# Altium schematic sheet 1 - SOM.SchDoc
size Tabloid
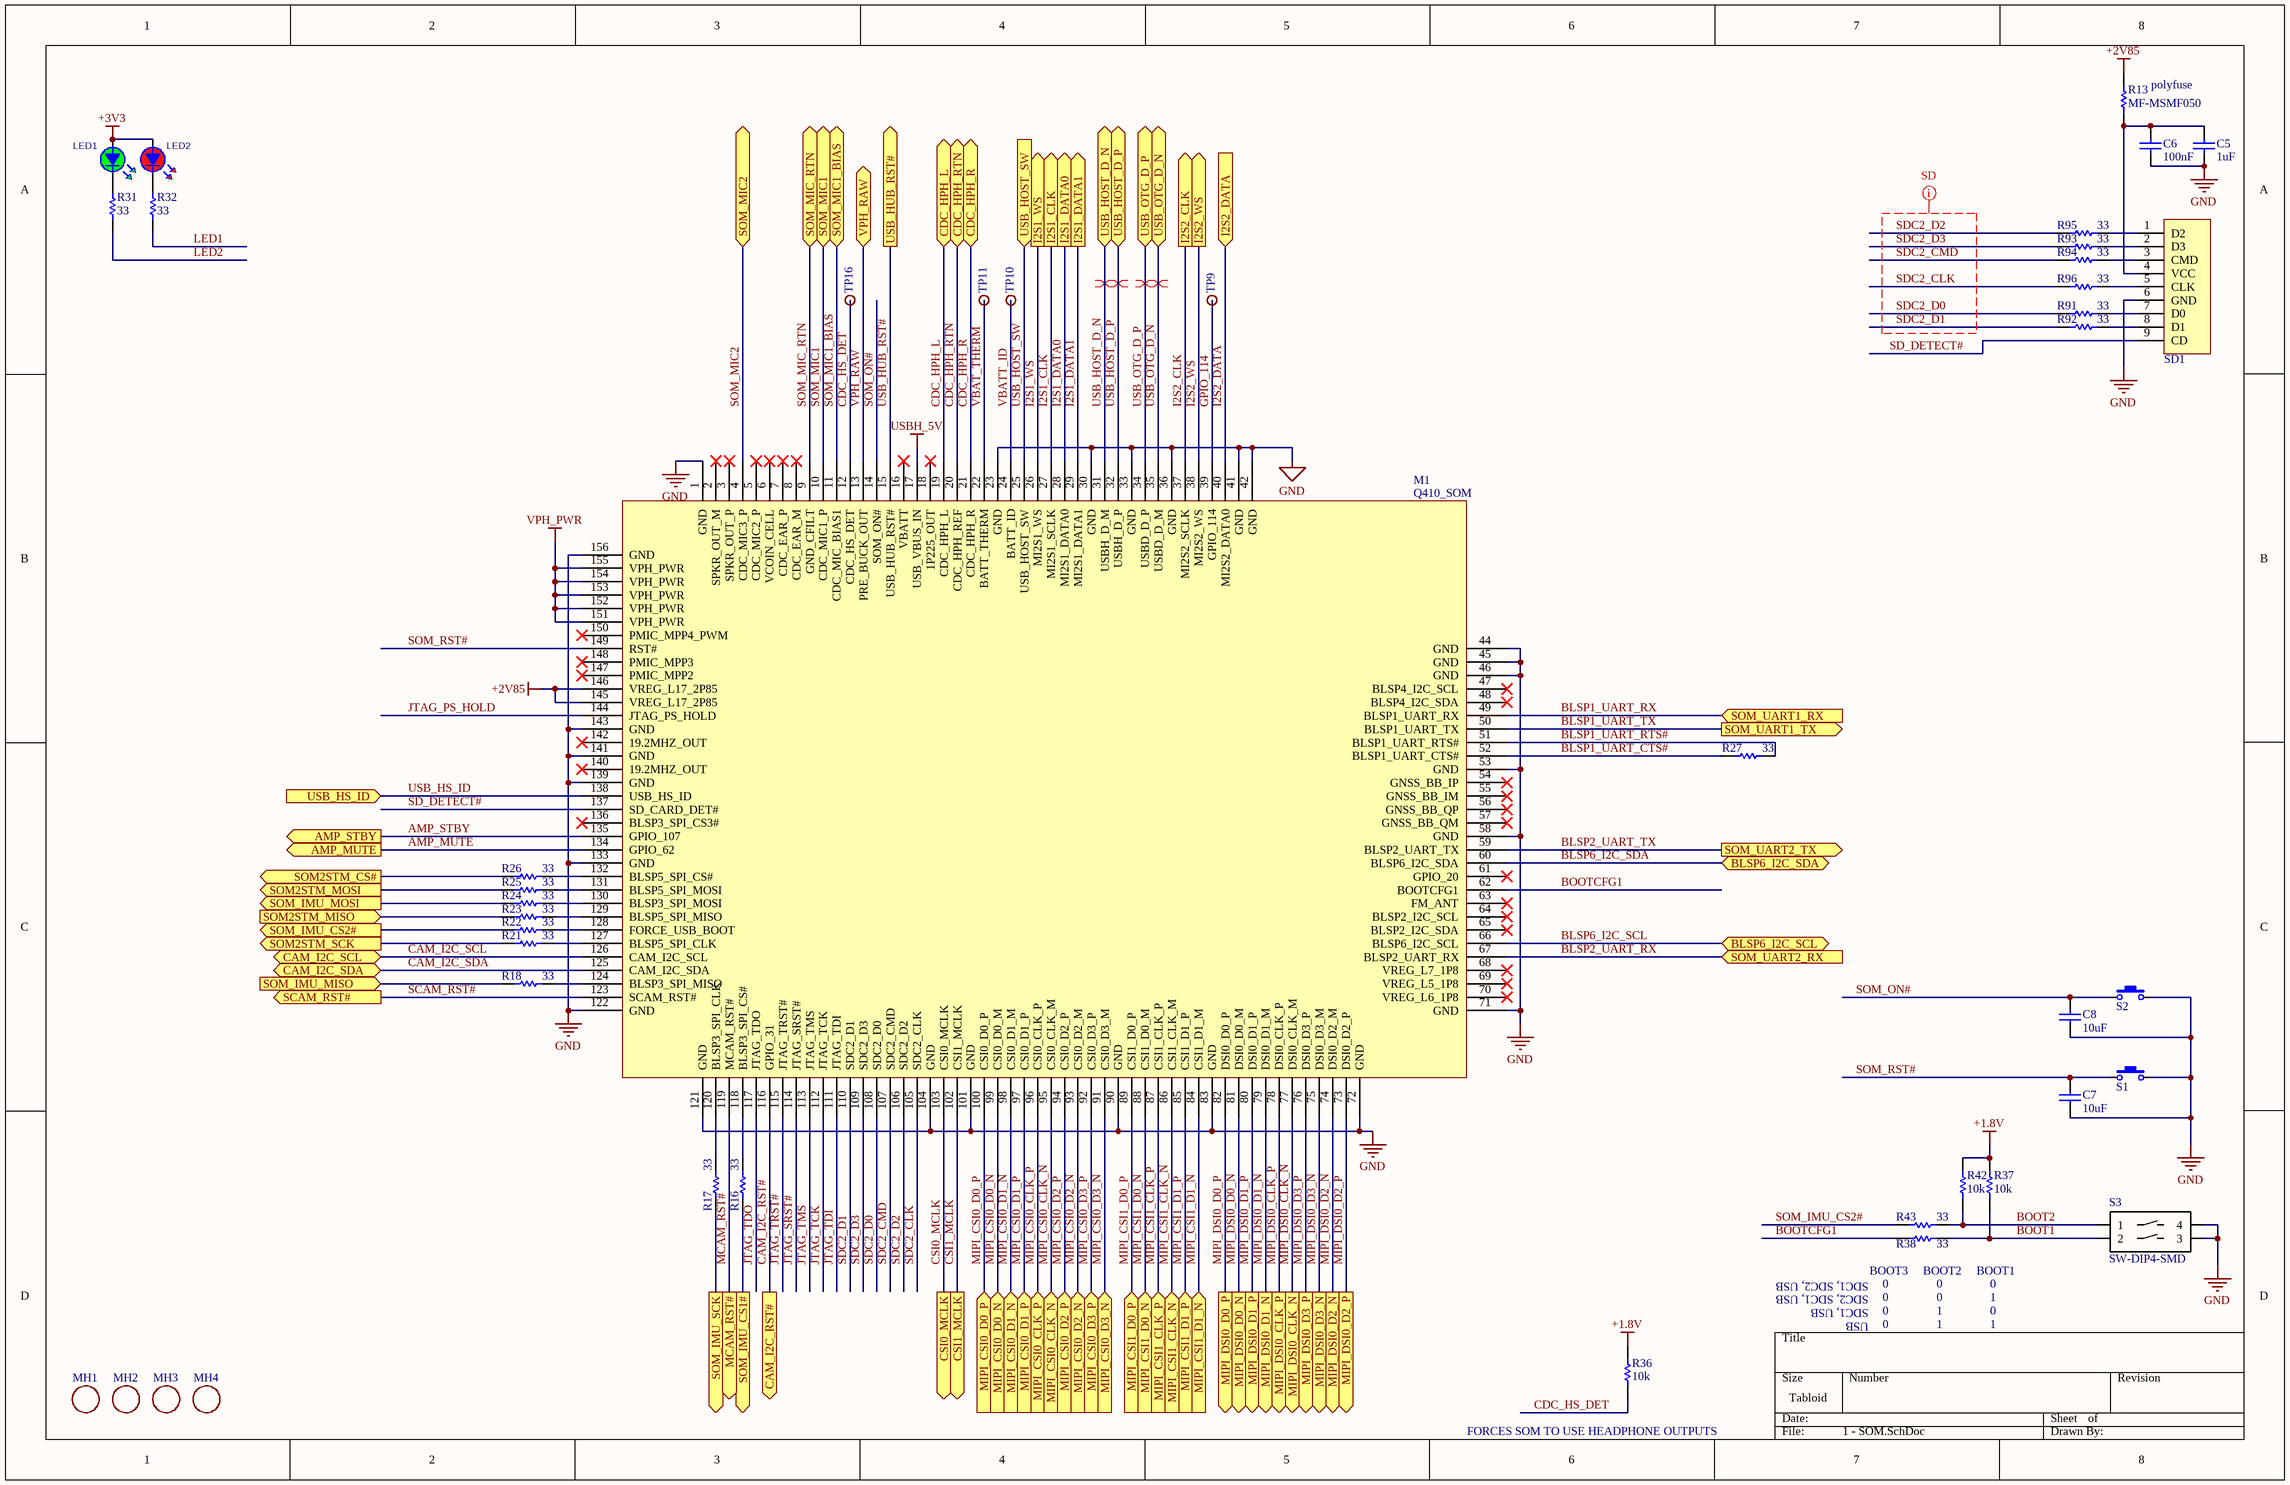
[diagram p0: 1 - SOM.SchDoc]

## Parts
C5  value 1uF  [CAPC0805(2012)100_L]  (hidden comment: CAP 1uF 6.3V 0805(2012))
C6  value 100nF  [CAPC0805(2012)100_N]  (hidden comment: CAP 100nF 6.3V 0805(2012))
C7  value 10uF  [CAPC0805(2012)100_L]  (hidden comment: CAP 10uF 6.3V 0805(2012))
C8  value 10uF  [CAPC0805(2012)100_L]  (hidden comment: CAP 10uF 6.3V 0805(2012))
LED1  VLMG1500-GS08  [LEDC0402(1005)_N-GRN]  (value not drawn)
LED2  VLMS1500-GS08  [LEDC0402(1005)_N-RED]  (value not drawn)
M1  Q410_SOM  [Q410]
MH1  MOUNTING_HOLE125  [HOLE_MTG_125]  (value not drawn)
MH2  MOUNTING_HOLE125  [HOLE_MTG_125]  (value not drawn)
MH3  MOUNTING_HOLE125  [HOLE_MTG_125]  (value not drawn)
MH4  MOUNTING_HOLE125  [HOLE_MTG_125]  (value not drawn)
R13  MF-MSMF050  [BOUR-MF-MSMF050-2_V]
R16  value 33  [RESC0805(2012)_L]
R17  value 33  [RESC0805(2012)_L]
R18  value 33  [RESC0805(2012)_L]
R21  value 33  [RESC0805(2012)_L]
R22  value 33  [RESC0805(2012)_L]
R23  value 33  [RESC0805(2012)_L]
R24  value 33  [RESC0805(2012)_L]
R25  value 33  [RESC0805(2012)_L]
R26  value 33  [RESC0805(2012)_L]
R27  value 33  [RESC0805(2012)_L]
R31  value 33  [RESC0805(2012)_L]
R32  value 33  [RESC0805(2012)_L]
R36  value 10k  [RESC0805(2012)_L]  (hidden comment: 10K 1% 0805(2012))
R37  value 10k  [RESC0805(2012)_L]  (hidden comment: 10K 1% 0805(2012))
R38  value 33  [RESC0805(2012)_L]
R42  value 10k  [RESC0805(2012)_L]  (hidden comment: 10K 1% 0805(2012))
R43  value 33  [RESC0805(2012)_L]
R91  value 33  [RESC0805(2012)_L]
R92  value 33  [RESC0805(2012)_L]
R93  value 33  [RESC0805(2012)_L]
R94  value 33  [RESC0805(2012)_L]
R95  value 33  [RESC0805(2012)_L]
R96  value 33  [RESC0805(2012)_L]
S1  ButtonTACT_3x4x2_180  [ButtonTACT_3x4x2_180]  (value not drawn)
S2  ButtonTACT_3x4x2_180  [ButtonTACT_3x4x2_180]  (value not drawn)
S3  SW-DIP4-SMD  [SO4SW]
SD1  SD_Card_TF  [SD_Card_TF]  (value not drawn)
TP9  Various test points  [VIAHOLE20]  (value not drawn)
TP10  Various test points  [VIAHOLE20]  (value not drawn)
TP11  Various test points  [VIAHOLE20]  (value not drawn)
TP16  Various test points  [VIAHOLE20]  (value not drawn)

## Ports
AMP_MUTE (out), AMP_STBY (out), BLSP6_I2C_SCL (bidir), BLSP6_I2C_SDA (bidir), CAM_I2C_RST# (out), CAM_I2C_SCL (bidir), CAM_I2C_SDA (bidir), CDC_HPH_L, CDC_HPH_R, CDC_HPH_RTN, CSI0_MCLK (out), CSI1_MCLK (out), I2S1_CLK (out), I2S1_DATA0 (out), I2S1_DATA1 (out), I2S1_WS (out), I2S2_CLK (out), I2S2_DATA (in), I2S2_WS (out), MCAM_RST# (out), MIPI_CSI0_CLK_N (in), MIPI_CSI0_CLK_P (in), MIPI_CSI0_D0_N (in), MIPI_CSI0_D0_P (in), MIPI_CSI0_D1_N (in), MIPI_CSI0_D1_P (in), MIPI_CSI0_D2_N (in), MIPI_CSI0_D2_P (in), MIPI_CSI0_D3_N (in), MIPI_CSI0_D3_P (in), MIPI_CSI1_CLK_N (in), MIPI_CSI1_CLK_P (in), MIPI_CSI1_D0_N (in), MIPI_CSI1_D0_P (in), MIPI_CSI1_D1_N (in), MIPI_CSI1_D1_P (in), MIPI_DSI0_CLK_N (out), MIPI_DSI0_CLK_P (out), MIPI_DSI0_D0_N (out), MIPI_DSI0_D0_P (out), MIPI_DSI0_D1_N (out), MIPI_DSI0_D1_P (out), MIPI_DSI0_D2_N (out), MIPI_DSI0_D2_P (out), MIPI_DSI0_D3_N (out), MIPI_DSI0_D3_P (out), SCAM_RST# (out), SOM2STM_CS# (out), SOM2STM_MISO (in), SOM2STM_MOSI (out), SOM2STM_SCK (out), SOM_IMU_CS1# (out), SOM_IMU_CS2# (out), SOM_IMU_MISO (in), SOM_IMU_MOSI (out), SOM_IMU_SCK (out), SOM_MIC1, SOM_MIC1_BIAS, SOM_MIC2, SOM_MIC_RTN, SOM_UART1_RX (in), SOM_UART1_TX (out), SOM_UART2_RX (in), SOM_UART2_TX (out), USB_HOST_D_N, USB_HOST_D_P, USB_HOST_SW (in), USB_HS_ID (in), USB_HUB_RST# (out), USB_OTG_D_N, USB_OTG_D_P, VPH_RAW

## Nets
+1.8V: R36.1 R37.1 R42.1
+2V85: M1.145(VREG_L17_2P85) M1.146(VREG_L17_2P85) R13.2
+3V3: LED1.A LED2.A
GND: C5.2 C6.2 C7.1 C8.1 M1.1(GND) M1.23(GND) M1.30(GND) M1.33(GND) M1.36(GND) M1.41(GND) M1.42(GND) M1.44(GND) M1.45(GND) M1.46(GND) M1.53(GND) M1.58(GND) M1.71(GND) M1.72(GND) M1.83(GND) M1.90(GND) M1.101(GND) M1.104(GND) M1.121(GND) M1.122(GND) M1.133(GND) M1.139(GND) M1.141(GND) M1.143(GND) M1.156(GND) S1.2 S2.2 S3.3 S3.4 SD1.6(GND)
USBH_5V: M1.17(USB_VBUS_IN)
VPH_PWR: M1.151(VPH_PWR) M1.152(VPH_PWR) M1.153(VPH_PWR) M1.154(VPH_PWR) M1.155(VPH_PWR)
AMP_MUTE: M1.134(GPIO_62) ; port AMP_MUTE
AMP_STBY: M1.135(GPIO_107) ; port AMP_STBY
BLSP1_UART_CTS#: M1.52(BLSP1_UART_CTS#) R27.2
BLSP1_UART_RTS#: M1.51(BLSP1_UART_RTS#) R27.1
BLSP1_UART_RX: M1.49(BLSP1_UART_RX) ; port SOM_UART1_RX
BLSP1_UART_TX: M1.50(BLSP1_UART_TX) ; port SOM_UART1_TX
BLSP2_UART_RX: M1.67(BLSP2_UART_RX) ; port SOM_UART2_RX
BLSP2_UART_TX: M1.59(BLSP2_UART_TX) ; port SOM_UART2_TX
BLSP6_I2C_SCL: M1.66(BLSP6_I2C_SCL) ; port BLSP6_I2C_SCL
BLSP6_I2C_SDA: M1.60(BLSP6_I2C_SDA) ; port BLSP6_I2C_SDA
BOOT1: R37.2 R38.1 S3.2
BOOT2: R42.2 R43.1 S3.1
BOOTCFG1: M1.62(BOOTCFG1) R38.2
CAM_I2C_RST#: M1.116(GPIO_31) ; port CAM_I2C_RST#
CAM_I2C_SCL: M1.126(CAM_I2C_SCL) ; port CAM_I2C_SCL
CAM_I2C_SDA: M1.125(CAM_I2C_SDA) ; port CAM_I2C_SDA
CDC_HPH_L: M1.19(CDC_HPH_L) ; port CDC_HPH_L
CDC_HPH_R: M1.21(CDC_HPH_R) ; port CDC_HPH_R
CDC_HPH_RTN: M1.20(CDC_HPH_REF) ; port CDC_HPH_RTN
CDC_HS_DET: M1.12(CDC_HS_DET) R36.2 TP16.1
CSI0_MCLK: M1.103(CSI0_MCLK) ; port CSI0_MCLK
CSI1_MCLK: M1.102(CSI1_MCLK) ; port CSI1_MCLK
GPIO_114: M1.39(GPIO_114) TP9.1
I2S1_CLK: M1.27(MI2S1_SCLK) ; port I2S1_CLK
I2S1_DATA0: M1.28(MI2S1_DATA0) ; port I2S1_DATA0
I2S1_DATA1: M1.29(MI2S1_DATA1) ; port I2S1_DATA1
I2S1_WS: M1.26(MI2S1_WS) ; port I2S1_WS
I2S2_CLK: M1.37(MI2S2_SCLK) ; port I2S2_CLK
I2S2_DATA: M1.40(MI2S2_DATA0) ; port I2S2_DATA
I2S2_WS: M1.38(MI2S2_WS) ; port I2S2_WS
JTAG_PS_HOLD: M1.144(JTAG_PS_HOLD)
JTAG_SRST#: M1.114(JTAG_SRST#)
JTAG_TCK: M1.112(JTAG_TCK)
JTAG_TDI: M1.111(JTAG_TDI)
JTAG_TDO: M1.117(JTAG_TDO)
JTAG_TMS: M1.113(JTAG_TMS)
JTAG_TRST#: M1.115(JTAG_TRST#)
LED1: R32.2
LED2: R31.2
MCAM_RST#: M1.119(MCAM_RST#) ; port MCAM_RST#
MIPI_CSI0_CLK_N: M1.95(CSI0_CLK_M) ; port MIPI_CSI0_CLK_N
MIPI_CSI0_CLK_P: M1.96(CSI0_CLK_P) ; port MIPI_CSI0_CLK_P
MIPI_CSI0_D0_N: M1.99(CSI0_D0_M) ; port MIPI_CSI0_D0_N
MIPI_CSI0_D0_P: M1.100(CSI0_D0_P) ; port MIPI_CSI0_D0_P
MIPI_CSI0_D1_N: M1.98(CSI0_D1_M) ; port MIPI_CSI0_D1_N
MIPI_CSI0_D1_P: M1.97(CSI0_D1_P) ; port MIPI_CSI0_D1_P
MIPI_CSI0_D2_N: M1.93(CSI0_D2_M) ; port MIPI_CSI0_D2_N
MIPI_CSI0_D2_P: M1.94(CSI0_D2_P) ; port MIPI_CSI0_D2_P
MIPI_CSI0_D3_N: M1.91(CSI0_D3_M) ; port MIPI_CSI0_D3_N
MIPI_CSI0_D3_P: M1.92(CSI0_D3_P) ; port MIPI_CSI0_D3_P
MIPI_CSI1_CLK_N: M1.86(CSI1_CLK_M) ; port MIPI_CSI1_CLK_N
MIPI_CSI1_CLK_P: M1.87(CSI1_CLK_P) ; port MIPI_CSI1_CLK_P
MIPI_CSI1_D0_N: M1.88(CSI1_D0_M) ; port MIPI_CSI1_D0_N
MIPI_CSI1_D0_P: M1.89(CSI1_D0_P) ; port MIPI_CSI1_D0_P
MIPI_CSI1_D1_N: M1.84(CSI1_D1_M) ; port MIPI_CSI1_D1_N
MIPI_CSI1_D1_P: M1.85(CSI1_D1_P) ; port MIPI_CSI1_D1_P
MIPI_DSI0_CLK_N: M1.77(DSI0_CLK_M) ; port MIPI_DSI0_CLK_N
MIPI_DSI0_CLK_P: M1.78(DSI0_CLK_P) ; port MIPI_DSI0_CLK_P
MIPI_DSI0_D0_N: M1.81(DSI0_D0_M) ; port MIPI_DSI0_D0_N
MIPI_DSI0_D0_P: M1.82(DSI0_D0_P) ; port MIPI_DSI0_D0_P
MIPI_DSI0_D1_N: M1.79(DSI0_D1_M) ; port MIPI_DSI0_D1_N
MIPI_DSI0_D1_P: M1.80(DSI0_D1_P) ; port MIPI_DSI0_D1_P
MIPI_DSI0_D2_N: M1.74(DSI0_D2_M) ; port MIPI_DSI0_D2_N
MIPI_DSI0_D2_P: M1.73(DSI0_D2_P) ; port MIPI_DSI0_D2_P
MIPI_DSI0_D3_N: M1.75(DSI0_D3_M) ; port MIPI_DSI0_D3_N
MIPI_DSI0_D3_P: M1.76(DSI0_D3_P) ; port MIPI_DSI0_D3_P
SCAM_RST#: M1.123(SCAM_RST#) ; port SCAM_RST#
SD_DETECT#: M1.137(SD_CARD_DET#) SD1.9(CD)
SDC2_CLK: M1.105(SDC2_CLK) R96.2
SDC2_CMD: M1.107(SDC2_CMD) R94.2
SDC2_D0: M1.108(SDC2_D0) R91.2
SDC2_D1: M1.110(SDC2_D1) R92.2
SDC2_D2: M1.106(SDC2_D2) R95.2
SDC2_D3: M1.109(SDC2_D3) R93.2
SOM2STM_CS#: R26.2 ; port SOM2STM_CS#
SOM2STM_MISO: R23.2 ; port SOM2STM_MISO
SOM2STM_MOSI: R25.2 ; port SOM2STM_MOSI
SOM2STM_SCK: R21.2 ; port SOM2STM_SCK
SOM_IMU_CS1#: R16.2 ; port SOM_IMU_CS1#
SOM_IMU_CS2#: R43.2
SOM_IMU_CS2#: R22.2 ; port SOM_IMU_CS2#  [a separate net that carries the same name]
SOM_IMU_MISO: R18.2 ; port SOM_IMU_MISO
SOM_IMU_MOSI: R24.2 ; port SOM_IMU_MOSI
SOM_IMU_SCK: R17.2 ; port SOM_IMU_SCK
SOM_MIC1: M1.10(CDC_MIC1_P) ; port SOM_MIC1
SOM_MIC1_BIAS: M1.11(CDC_MIC_BIAS1) ; port SOM_MIC1_BIAS
SOM_MIC2: M1.4(CDC_MIC3_P) ; port SOM_MIC2
SOM_MIC_RTN: M1.9(GND_CFILT) ; port SOM_MIC_RTN
SOM_ON#: C8.2 M1.14(SOM_ON#) S2.1
SOM_RST#: C7.2 M1.149(RST#) S1.1
USB_HOST_D_N: M1.31(USBH_D_M) ; port USB_HOST_D_N
USB_HOST_D_P: M1.32(USBH_D_P) ; port USB_HOST_D_P
USB_HOST_SW: M1.25(USB_HOST_SW) ; port USB_HOST_SW
USB_HS_ID: M1.138(USB_HS_ID) ; port USB_HS_ID
USB_HUB_RST#: M1.15(USB_HUB_RST#) ; port USB_HUB_RST#
USB_OTG_D_N: M1.35(USBD_D_M) ; port USB_OTG_D_N
USB_OTG_D_P: M1.34(USBD_D_P) ; port USB_OTG_D_P
VBAT_THERM: M1.22(BATT_THERM) TP11.1
VBATT_ID: M1.24(BATT_ID) TP10.1
VPH_RAW: M1.13(PRE_BUCK_OUT) ; port VPH_RAW
NetC5_1: C5.1 C6.1 R13.1 SD1.4(VCC)
NetLED1_K: LED1.K R31.1
NetLED2_K: LED2.K R32.1
NetM1_118: M1.118(BLSP3_SPI_CS#) R16.1
NetM1_120: M1.120(BLSP3_SPI_CLK) R17.1
NetM1_124: M1.124(BLSP3_SPI_MISO) R18.1
NetM1_127: M1.127(BLSP5_SPI_CLK) R21.1
NetM1_128: M1.128(FORCE_USB_BOOT) R22.1
NetM1_129: M1.129(BLSP5_SPI_MISO) R23.1
NetM1_130: M1.130(BLSP3_SPI_MOSI) R24.1
NetM1_131: M1.131(BLSP5_SPI_MOSI) R25.1
NetM1_132: M1.132(BLSP5_SPI_CS#) R26.1
NetR91_1: R91.1 SD1.7(D0)
NetR92_1: R92.1 SD1.8(D1)
NetR93_1: R93.1 SD1.2(D3)
NetR94_1: R94.1 SD1.3(CMD)
NetR95_1: R95.1 SD1.1(D2)
NetR96_1: R96.1 SD1.5(CLK)

Not connected (* = marked no-connect by the designer): M1 2(SPKR_OUT_M)* 3(SPKR_OUT_P)* 5(CDC_MIC2_P)* 6(VCOIN_CELL)* 7(CDC_EAR_P)* 8(CDC_EAR_M)* 16(VBATT)* 18(1P225_OUT)* 47(BLSP4_I2C_SCL)* 48(BLSP4_I2C_SDA)* 54(GNSS_BB_IP)* 55(GNSS_BB_IM)* 56(GNSS_BB_QP)* 57(GNSS_BB_QM)* 61(GPIO_20)* 63(FM_ANT)* 64(BLSP2_I2C_SCL)* 65(BLSP2_I2C_SDA)* 68(VREG_L7_1P8)* 69(VREG_L5_1P8)* 70(VREG_L6_1P8)* 136(BLSP3_SPI_CS3#)* 140(19.2MHZ_OUT)* 142(19.2MHZ_OUT)* 147(PMIC_MPP2)* 148(PMIC_MPP3)* 150(PMIC_MPP4_PWM)*

## Layout directives
differential pair: USB_HOST_D_N, USB_HOST_D_P, USB_OTG_D_N, USB_OTG_D_P
net class SD: SDC2_CLK, SDC2_CMD, SDC2_D0, SDC2_D1, SDC2_D2, SDC2_D3

## Notes on the sheet
- (near R13) polyfuse
- SDC1, SDC2, USB
- SDC2, SDC1, USB
- SDC1, USB
- BOOT3
- 0
- BOOT2
- BOOT1
- 1
- USB
- (near R36) FORCES SOM TO USE HEADPHONE OUTPUTS

## Library data of the parts
C5 = CMP-1036-04730-1: CAP 1uF 6.3V Â±5% 0805 (2012 Metric) Thickness 1mm SMD; Case-Metric: 2012; Case-EIA: 0805; Technology: SMT; Tolerance: Â±5%; Max Thickness: 1 mm; Rated Voltage: 6.3 V
C6 = CMP-1036-04391-1: CAP 100nF 6.3V Â±10% 0805 (2012 Metric) Thickness 1mm SMD; Case-EIA: 0805; Case-Metric: 2012; Rated Voltage: 6.3 V; Technology: SMT; Tolerance: Â±10%; Max Thickness: 1 mm
C7 C8 = CMP-1036-04917-1: CAP 10uF 6.3V Â±10% 0805 (2012 Metric) Thickness 1mm SMD; Case-EIA: 0805; Case-Metric: 2012; Max Thickness: 1 mm; Tolerance: Â±10%; Technology: SMT; Rated Voltage: 6.3 V
LED1 = LED_0402_VLMG1500-GS08: LED GREEN 0402 SMD; Manufacturer: Vishay Semiconductor Opto Division; Wavelength - Dominant: 571nm; Wavelength - Peak: 574nm; Millicandela Rating: 35mcd; Voltage - Forward (Vf) (Typ): 2V; Current - Test: 20mA; Viewing Angle: 130°; Lens Style/Size: Rectangle with Flat Top, 1.00mm x 0.50mm; Supplier 1: Digi-Key; Manufacturer Part Number: VLMG1500-GS08; RoHS: RoHS Compliant; Category: Optoelectronics; Stock 1: 37065; Pricing 1: 1=0.52, 10=0.384, 25=0.3072, 100=0.2035, 250=0.144, 500=0.12288, 750=0.10368, 1000=0.096 (USD); Packaging: Cut Tape (CT); Color: Green; Lens Transparency: -; Lens Color: -; Package / Case: 0402 (1005 Metric); Supplier Device Package: 0402; Size / Dimension: 1.00mm L x 0.50mm W; Height (Max): 0.35mm; Mounting Type: Surface Mount; ComponentLink1URL: http://www.vishay.com/docs/82554/vlmo1500.pdf; ComponentLink1Description: http://www.vishay.com/docs/82554/vlmo1500.pdf; Supplier Part Number 1: VLMG1500-GS08CT-ND
LED2 = LED_0402_VLMS1500-GS08: LED RED 0402 SMD; Manufacturer: Vishay Semiconductor Opto Division; Wavelength - Dominant: 631nm; Wavelength - Peak: 639nm; Millicandela Rating: 54mcd; Voltage - Forward (Vf) (Typ): 2V; Current - Test: 20mA; Viewing Angle: 130°; Lens Style/Size: Rectangle with Flat Top, 1.00mm x 0.50mm; Supplier 1: Digi-Key; Manufacturer Part Number: VLMS1500-GS08; RoHS: RoHS Compliant; Category: Optoelectronics; Stock 1: 41406; Pricing 1: 1=0.52, 10=0.384, 25=0.3072, 100=0.2035, 250=0.144, 500=0.12288, 750=0.10368, 1000=0.096 (USD); Packaging: Cut Tape (CT); Color: Red; Lens Transparency: -; Lens Color: -; Package / Case: 0402 (1005 Metric); Supplier Device Package: 0402; Size / Dimension: 1.00mm L x 0.50mm W; Height (Max): 0.35mm; Mounting Type: Surface Mount; ComponentLink1URL: http://www.vishay.com/docs/82554/vlmo1500.pdf; ComponentLink1Description: http://www.vishay.com/docs/82554/vlmo1500.pdf; Supplier Part Number 1: VLMS1500-GS08CT-ND
M1 = Q410
R13 = CMP-0280-00002-2: MF-MSMF Series - PTC Resettable Fuse, 15 V Max, 0.15 Ohm Min, -40 to 85 degC, RoHS, Reel; Manufacturer: Bourns; Voltage DC (Max): 15 V; Trip Current: 1 A; Hold Current: 0.5 A; Current Rating (Max): 100 A; ComponentLink1Description: Manufacturer URL; Operating Temperature Range: -40 to 85 degC; ComponentLink2URL: http://www.bourns.com/data/global/pdfs/mfmsmf.pdf; PackageReference: MF-MSMF050; ComponentLink2Description: Datasheet; PartNumber: MF-MSMF050; DatasheetVersion: Rev. AD; ComponentLink3URL: http://www.bourns.com/data/global/pdfs/mfmsmf.pdf; ComponentLink3Description: Package Specification; RoHS: TRUE; PackageDescription: 2-Pin SMD, Body 4.55 x 3.24 mm; Mounting Technology: Surface Mount; Packing: Reel; Resistance (Min): 0.15 Ohm; ComponentLink1URL: http://www.bourns.com/
R16-R18 R21-R27 R31 R32 R36-R38 R42 R43 R91-R96 = CMP-1013-00623-1: 10K 0.125W 1% 0805 (2012 Metric)  SMD; Case-Metric: 2012; Case-EIA: 0805; Tolerance: 1 %; Power: 0.125 W; Technology: SMT
S1 S2 = ButtonTACT_3x4x2_180: Button
S3 = SW-DIP4-SMD: 2 POLE DIP SWITCH SMD
SD1 = SD_Card_TF: SD
TP9-TP11 TP16 = TESTPOINTHOLE035